# Altium schematic sheet 23005_1.SchDoc: Classic Computer IO Platform
size A3; Date: 06/11/2018; CompanyName: Heber Ltd; Organization: Heber Limited; DocumentNumber: 56-23005; 1: 1; SheetNumber: 1; SheetTotal: 6; Revision: 2
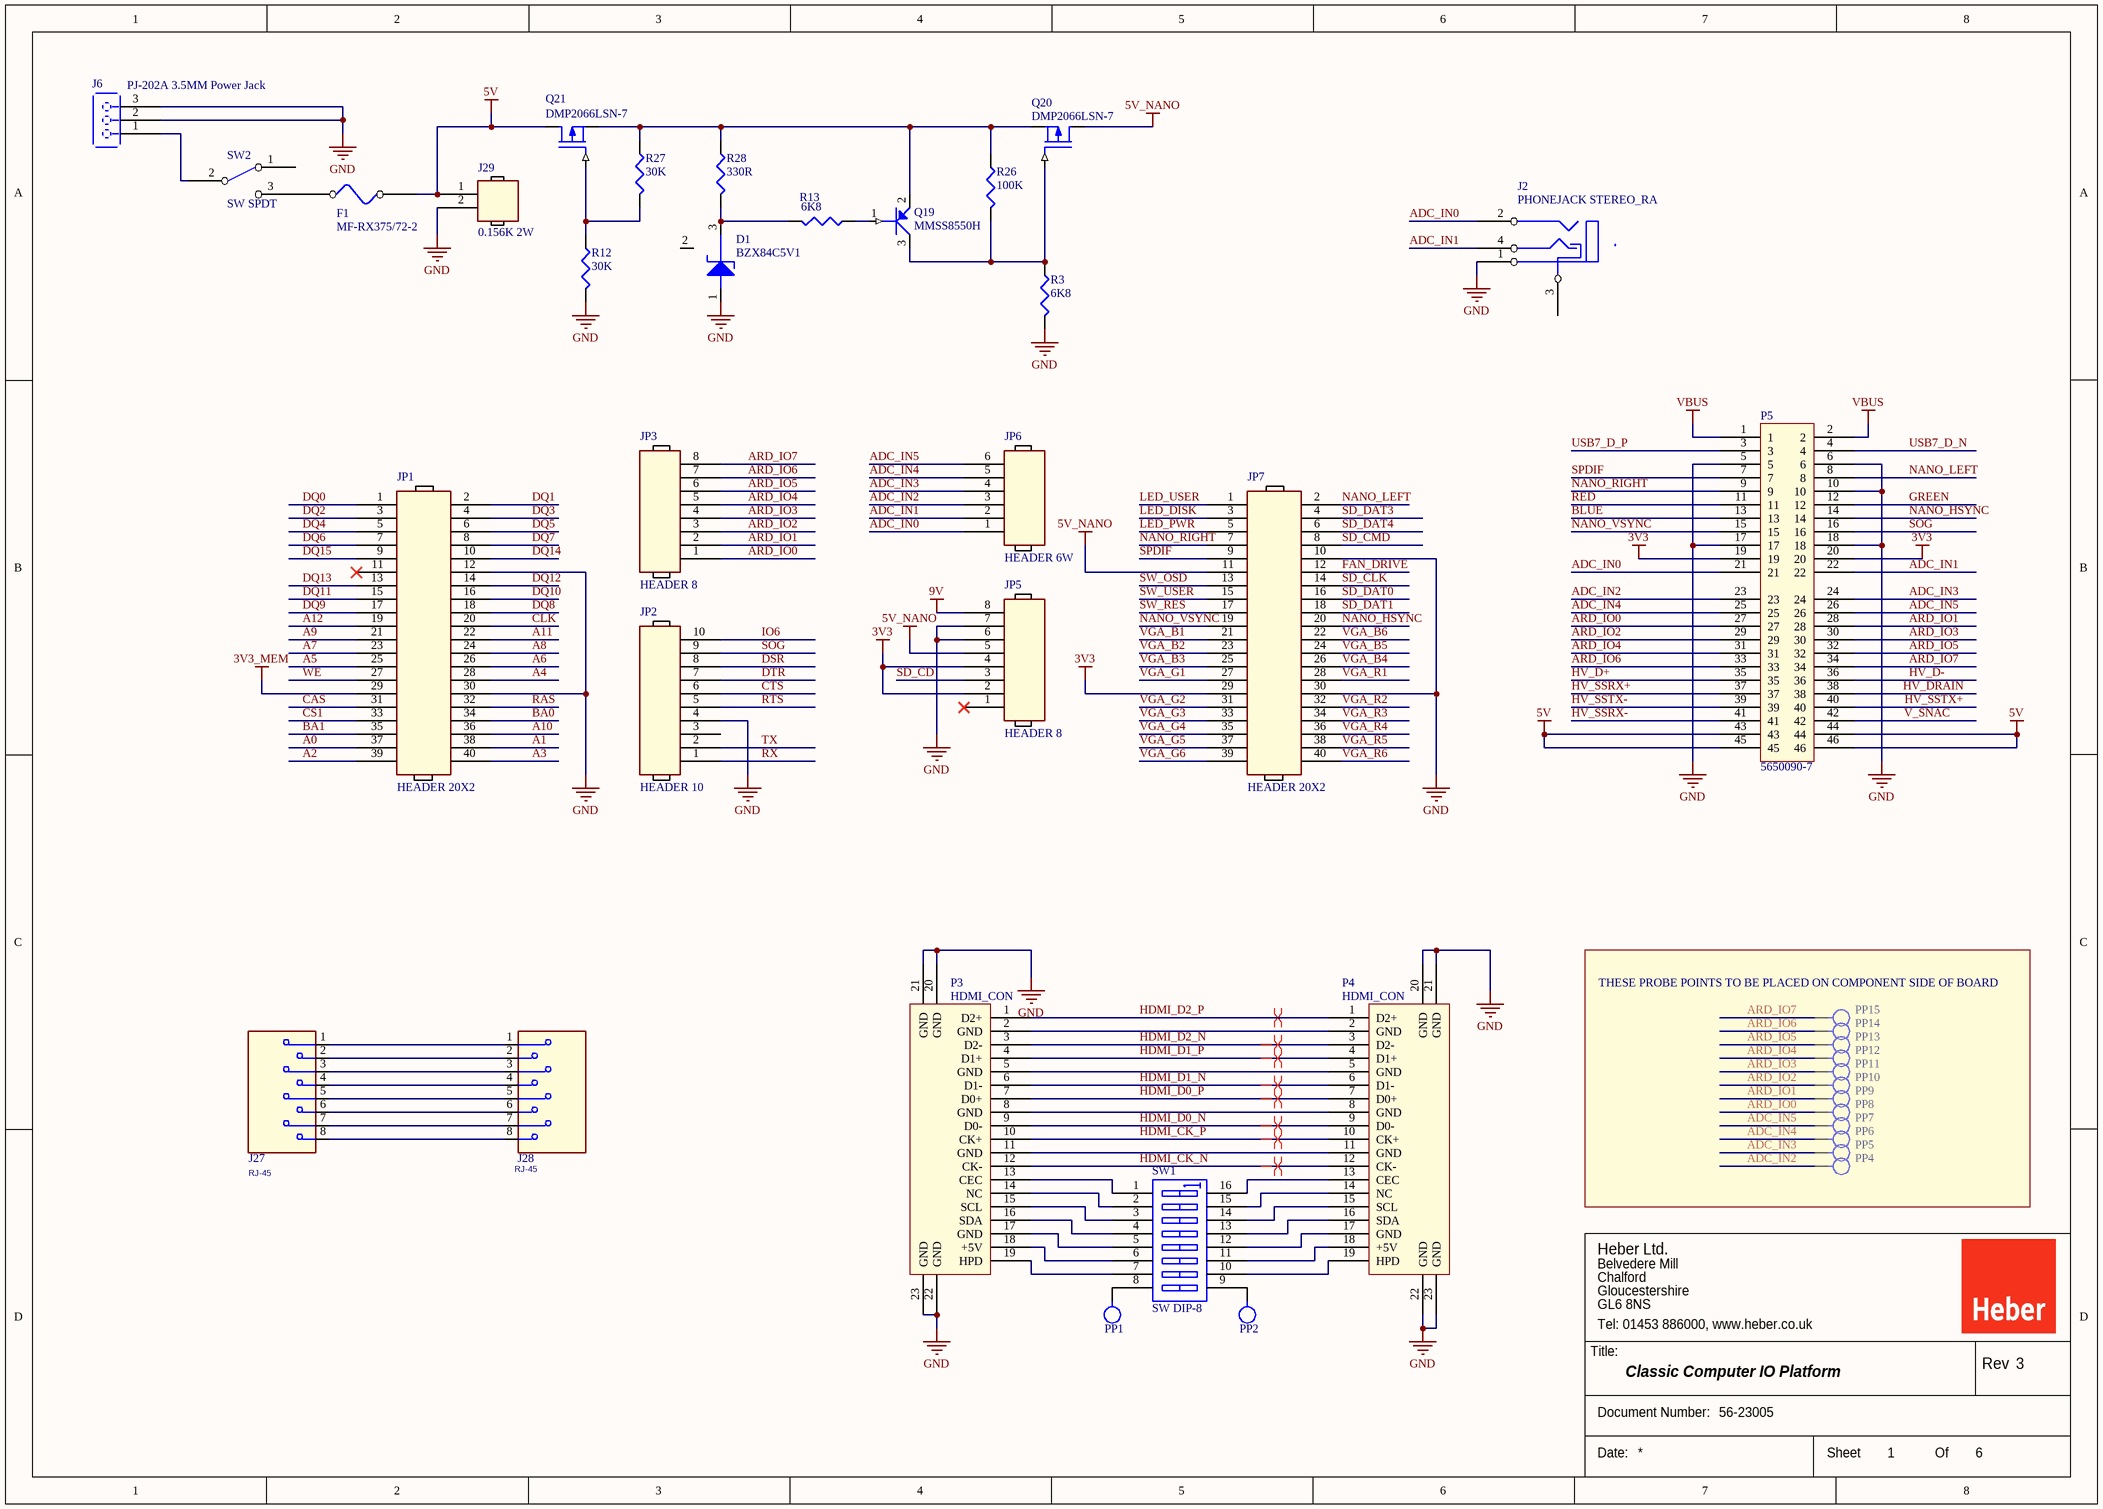
[diagram p0: 23005_1.SchDoc]

## Parts
D1  BZX84C5V1  [SOT23]
F1  MF-RX375/72-2  [FUSE-MF-RX375/72-2]
J2  PHONEJACK STEREO_RA  [JACKSOCKET-STEREO]
J6  PJ-202A 3.5MM Power Jack  [CUI_PJ-202A]
J27  RJ-45  [P-RJHSE-XE80]
J28  RJ-45  [P-RJHSE-XE80]
J29  0.156K 2W  [2W156KK]
JP1  HEADER 20X2  [40WHDR_20X2 - DE10-NANO]
JP2  HEADER 10  [10WSIL]
JP3  HEADER 8  [8WSIL]
JP5  HEADER 8  [8WSIL]
JP6  HEADER 6W  [6WSIL]
JP7  HEADER 20X2  [40WHDR_20X2 - DE10-NANO]
P3  HDMI_CON  [AMPFCI_1029449]
P4  HDMI_CON  [AMPFCI_1029449]
P5  5650090-7  [AMC_RISER2]
PP1  PROBEPOINT_SHORT  [1MM_WIRING]  (value not drawn)
PP2  PROBEPOINT_SHORT  [1MM_WIRING]  (value not drawn)
PP4  PROBEPOINT_SHORT  [PROBEPOINT]  (value not drawn)
PP5  PROBEPOINT_SHORT  [PROBEPOINT]  (value not drawn)
PP6  PROBEPOINT_SHORT  [PROBEPOINT]  (value not drawn)
PP7  PROBEPOINT_SHORT  [PROBEPOINT]  (value not drawn)
PP8  PROBEPOINT_SHORT  [PROBEPOINT]  (value not drawn)
PP9  PROBEPOINT_SHORT  [PROBEPOINT]  (value not drawn)
PP10  PROBEPOINT_SHORT  [PROBEPOINT]  (value not drawn)
PP11  PROBEPOINT_SHORT  [PROBEPOINT]  (value not drawn)
PP12  PROBEPOINT_SHORT  [PROBEPOINT]  (value not drawn)
PP13  PROBEPOINT_SHORT  [PROBEPOINT]  (value not drawn)
PP14  PROBEPOINT_SHORT  [PROBEPOINT]  (value not drawn)
PP15  PROBEPOINT_SHORT  [PROBEPOINT]  (value not drawn)
Q19  MMSS8550H  [SOT23]
Q20  DMP2066LSN-7  [SOT23]
Q21  DMP2066LSN-7  [SOT23]
R3  6K8  [SM0603]
R12  30K  [SM0603]
R13  6K8  [SM0603]
R26  100K  [SM0603]
R27  30K  [SM0603]
R28  330R  [SM0603]
SW1  SW DIP-8  [8WSWITCH]
SW2  SW SPDT  [SW_CK_L102011ml04Q]

## Blocks framed on the sheet
THESE PROBE POINTS TO BE PLACED ON COMPONENT SIDE OF BOARD: PP4-PP15

## Nets
3V3: JP5.2 JP5.4 JP7.29 P5.19 P5.20
3V3_MEM: JP1.29
5V: F1.2 J29.1 P5.43 P5.44 P5.45 P5.46 Q21.3(DRAIN)
5V_NANO: JP5.5 JP7.11 Q20.3(DRAIN)
9V: JP5.8
GND: D1.1(ANODE) J2.1 J6.2 J6.3 J29.2 JP1.12 JP1.30 JP2.4 JP5.6 JP5.7 JP7.10 JP7.30 P3.20(GND) P3.21(GND) P3.22(GND) P3.23(GND) P4.20(GND) P4.21(GND) P4.22(GND) P4.23(GND) P5.5 P5.6 P5.10 P5.17 P5.18 R3.2 R12.2
VBUS: P5.1 P5.2
A0: JP1.37
A1: JP1.38
A2: JP1.39
A3: JP1.40
A4: JP1.28
A5: JP1.25
A6: JP1.26
A7: JP1.23
A8: JP1.24
A9: JP1.21
A10: JP1.36
A11: JP1.22
A12: JP1.19
ADC_IN0: J2.2 JP6.1 P5.21
ADC_IN1: J2.4 JP6.2 P5.22
ADC_IN2: JP6.3 P5.23 PP4.1
ADC_IN3: JP6.4 P5.24 PP5.1
ADC_IN4: JP6.5 P5.25 PP6.1
ADC_IN5: JP6.6 P5.26 PP7.1
ARD_IO0: JP3.1 P5.27 PP8.1
ARD_IO1: JP3.2 P5.28 PP9.1
ARD_IO2: JP3.3 P5.29 PP10.1
ARD_IO3: JP3.4 P5.30 PP11.1
ARD_IO4: JP3.5 P5.31 PP12.1
ARD_IO5: JP3.6 P5.32 PP13.1
ARD_IO6: JP3.7 P5.33 PP14.1
ARD_IO7: JP3.8 P5.34 PP15.1
BA0: JP1.34
BA1: JP1.35
BLUE: P5.13
CAS: JP1.31
CLK: JP1.20
CS1: JP1.33
CTS: JP2.6
DQ0: JP1.1
DQ1: JP1.2
DQ2: JP1.3
DQ3: JP1.4
DQ4: JP1.5
DQ5: JP1.6
DQ6: JP1.7
DQ7: JP1.8
DQ8: JP1.18
DQ9: JP1.17
DQ10: JP1.16
DQ11: JP1.15
DQ12: JP1.14
DQ13: JP1.13
DQ14: JP1.10
DQ15: JP1.9
DSR: JP2.8
DTR: JP2.7
FAN_DRIVE: JP7.12
GREEN: P5.12
HDMI_CK_N: P3.12(CK-) P4.12(CK-)
HDMI_CK_P: P3.10(CK+) P4.10(CK+)
HDMI_D0_N: P3.9(D0-) P4.9(D0-)
HDMI_D0_P: P3.7(D0+) P4.7(D0+)
HDMI_D1_N: P3.6(D1-) P4.6(D1-)
HDMI_D1_P: P3.4(D1+) P4.4(D1+)
HDMI_D2_N: P3.3(D2-) P4.3(D2-)
HDMI_D2_P: P3.1(D2+) P4.1(D2+)
HV_D+: P5.35
HV_D-: P5.36
HV_DRAIN: P5.38
HV_SSRX+: P5.37
HV_SSRX-: P5.41
HV_SSTX+: P5.40
HV_SSTX-: P5.39
IO6: JP2.10
LED_DISK: JP7.3
LED_PWR: JP7.5
LED_USER: JP7.1
NANO_HSYNC: JP7.20 P5.14
NANO_LEFT: JP7.2 P5.8
NANO_RIGHT: JP7.7 P5.9
NANO_VSYNC: JP7.19 P5.15
RAS: JP1.32
RED: P5.11
RTS: JP2.5
RX: JP2.1
SD_CD: JP5.3
SD_CLK: JP7.14
SD_CMD: JP7.8
SD_DAT0: JP7.16
SD_DAT1: JP7.18
SD_DAT3: JP7.4
SD_DAT4: JP7.6
SOG: JP2.9 P5.16
SPDIF: JP7.9 P5.7
SW_OSD: JP7.13
SW_RES: JP7.17
SW_USER: JP7.15
TX: JP2.2
USB7_D_N: P5.4
USB7_D_P: P5.3
V_SNAC: P5.42
VGA_B1: JP7.21
VGA_B2: JP7.23
VGA_B3: JP7.25
VGA_B4: JP7.26
VGA_B5: JP7.24
VGA_B6: JP7.22
VGA_G1: JP7.27
VGA_G2: JP7.31
VGA_G3: JP7.33
VGA_G4: JP7.35
VGA_G5: JP7.37
VGA_G6: JP7.39
VGA_R1: JP7.28
VGA_R2: JP7.32
VGA_R3: JP7.34
VGA_R4: JP7.36
VGA_R5: JP7.38
VGA_R6: JP7.40
WE: JP1.27
NetD1_3: D1.3(CATHODE) R13.2 R28.2
NetF1_1: F1.1 SW2.3(NO)
NetJ6_1: J6.1 SW2.2(COMMON)
NetJ27_1: J27.1 J28.1
NetJ27_2: J27.2 J28.2
NetJ27_3: J27.3 J28.3
NetJ27_4: J27.4 J28.4
NetJ27_5: J27.5 J28.5
NetJ27_6: J27.6 J28.6
NetJ27_7: J27.7 J28.7
NetJ27_8: J27.8 J28.8
NetP3_2: P3.2(GND) P4.2(GND)
NetP3_5: P3.5(GND) P4.5(GND)
NetP3_8: P3.8(GND) P4.8(GND)
NetP3_11: P3.11(GND) P4.11(GND)
NetP3_13: P3.13(CEC) SW1.1(A1)
NetP3_14: P3.14(NC) SW1.2(A2)
NetP3_15: P3.15(SCL) SW1.3(A3)
NetP3_16: P3.16(SDA) SW1.4(A4)
NetP3_17: P3.17(GND) SW1.5(A5)
NetP3_18: P3.18(+5V) SW1.6(A6)
NetP3_19: P3.19(HPD) SW1.7(A7)
NetP4_13: P4.13(CEC) SW1.16(B1)
NetP4_14: P4.14(NC) SW1.15(B2)
NetP4_15: P4.15(SCL) SW1.14(B3)
NetP4_16: P4.16(SDA) SW1.13(B4)
NetP4_17: P4.17(GND) SW1.12(B5)
NetP4_18: P4.18(+5V) SW1.11(B6)
NetP4_19: P4.19(HPD) SW1.10(B7)
NetPP1_1: PP1.1 SW1.8(A8)
NetPP2_1: PP2.1 SW1.9(B8)
NetQ19_1: Q19.1(BASE) R13.1
NetQ19_2: Q19.2(EMITTER) Q20.2(SOURCE) Q21.2(SOURCE) R26.1 R27.1 R28.1
NetQ19_3: Q19.3(COLLECTOR) Q20.1(GATE) R3.1 R26.2
NetQ21_1: Q21.1(GATE) R12.1 R27.2

Not connected (* = marked no-connect by the designer): D1 2(NC); J2 3; JP1 11*; JP2 3; JP5 1*; SW2 1(NC)

## Layout directives
differential pair; differential pair class HDMI: HDMI_CK_N, HDMI_CK_P, HDMI_D0_N, HDMI_D0_P, HDMI_D1_N, HDMI_D1_P, HDMI_D2_N, HDMI_D2_P

## Notes on the sheet
- Heber Ltd.
- Belvedere Mill
- Chalford
- GL6 8NS
- Gloucestershire
- Tel: 01453 886000, www.heber.co.uk
- Title:
- Rev
- 3
- Document Number:
- Date:
- Sheet
- Of

## Library data of the parts
D1 = ZENNER_SOT23
F1 = FUSE
J6 = PLUG 3W SIL
J27 J28 = RJ45
J29 = HEADER 2
Q19 = BC856AL
Q20 Q21 = MOSFET P
R3 R12 R13 R26-R28 = RES